# Altium schematic sheet Regulator 3v3-250mA MCP1702.SchDoc: Regulator 3v3 out
size A4; Organization: Altium Limited; Address1: 3 Minna Close; Address2: Belrose; Address3: NSW 2085; Address4: Australia
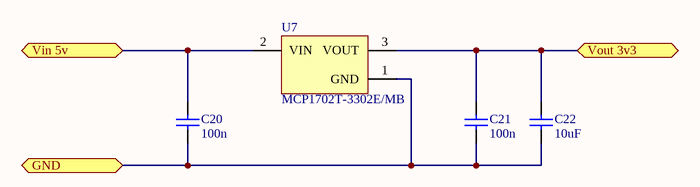
[diagram p0: Regulator 3v3-250mA MCP1702.SchDoc]

## Parts
C20  100n  [C0805]
C21  100n  [C0805]
C22  10uF  [C1206]
U7  MCP1702T-3302E/MB  [SOT-89-MB3_N]

## Ports
GND, Vin 5v, Vout 3v3

## Nets
GND: C20.1 C21.1 C22.1 U7.1(GND) ; port GND
Vin 5v: C20.2 U7.2(VIN) ; port Vin 5v
Vout 3v3: C21.2 C22.2 U7.3(VOUT) ; port Vout 3v3

## Notes on the sheet
- Disclaimer
  Any design and information, hardware or software  is provided on an "as-is" basis without warranty of any kind and any express or implied warranties, including, but not limited to, the implied warranties of merchantability and fitness for a particular purpose are disclaimed. In no event shall wnpd (or KeaDrone)be liable for any direct, indirect, incidental, special, exemplary, or consequential damages (including, but not limited to, procurement of substitute goods or services; loss of use, data, or profits; or business interruption) however caused and on any theory of liability, whether in contract, strict liability, or tort (including negligence or otherwise) arising in any way out of the use of this firmware, hardware, software or information, even if wnpd (or KeaDrone) has been advised by user of the possibility of such potential loss or damage. The user agrees to hold wnpd (or KeaDrone) harmless from and against any and all claims, losses, liabilities and expenses.
- Title
- Size:
- Date:
- A4
- Name:
- Time:
- Ing. W. Pietersz
- Revision:
- Sheet
- of
- WillyPietersz@gmail.com
- Contact:
- -
- www.wnpd.nl
- File:

## Library data of the parts
C20 C21 = 100n: Tolerance: 0.1; LatestRevision Note: Initial Release; Part Number: 100n; Value: 100n; Package: 0805; Component Type: Standard; LatestRevision Date: 31-7-2010; Author: Willy Pietersz; Supplier 2: Farnell; Supplier Part Number 2: 1759266; ComponentLink1Description: Manufacturer; ComponentLink2Description: Datasheet
C22 = 10uF: Voltage: 10V; Type: Ceramic; Tolerance: 0.1; LatestRevision Note: Initial Release; Part Number: 10uF; Value: 10uF; Package: 1206; Component Type: Standard; LatestRevision Date: 14-9-2010; Author: Willem Pietersz; Supplier 2: Farnell; Supplier Part Number 2: 1759434; ComponentLink1Description: Manufacturer; ComponentLink2Description: Datasheet
U7 = MCP1702T-3302E/MB: Power, 250 mA Low Quiescent Current LDO Regulator, 3-Pin SOT-89, Extended Temperature, Tape and Reel; FirstPublished: 29-Jan-2009; LatestRevisionDate: 02-Dec-2009; LatestRevisionNote: Updated to datasheet revision D, Jun-2009; DatasheetVersion: revD, Jun-2009; PackageVersion: revBB, Aug-2009; PackageReference: SOT-89-MB3; Publisher: Altium Limited; PackageDescription: 3-Lead Plastic Small Outline Transistor Header (MB) [SOT-89]; Supplier 1: Digi-Key; Supplier Part Number 1: MCP1702T-3302E/MB-ND; Supplier 2: Farnell; Supplier Part Number 2: 1605558; Supplier 3: Newark; Supplier Part Number 3: 56K6993; Code_IPC: SOT89; ComponentLink1Description: Datasheet; ComponentLink1URL: http://ww1.microchip.com/downloads/en/DeviceDoc/22008d.pdf; ComponentLink2Description: Packaging Specification; ComponentLink2URL: http://www.microchip.com/stellent/groups/techpub_sg/documents/packagingspec/en012702.pdf; ComponentLink3Description: Microchip.com Home; ComponentLink3URL: http://www.microchip.com/